# Altium schematic sheet ts2068Interface.SchDoc
size A; SheetNumber: 2; SheetTotal: 5
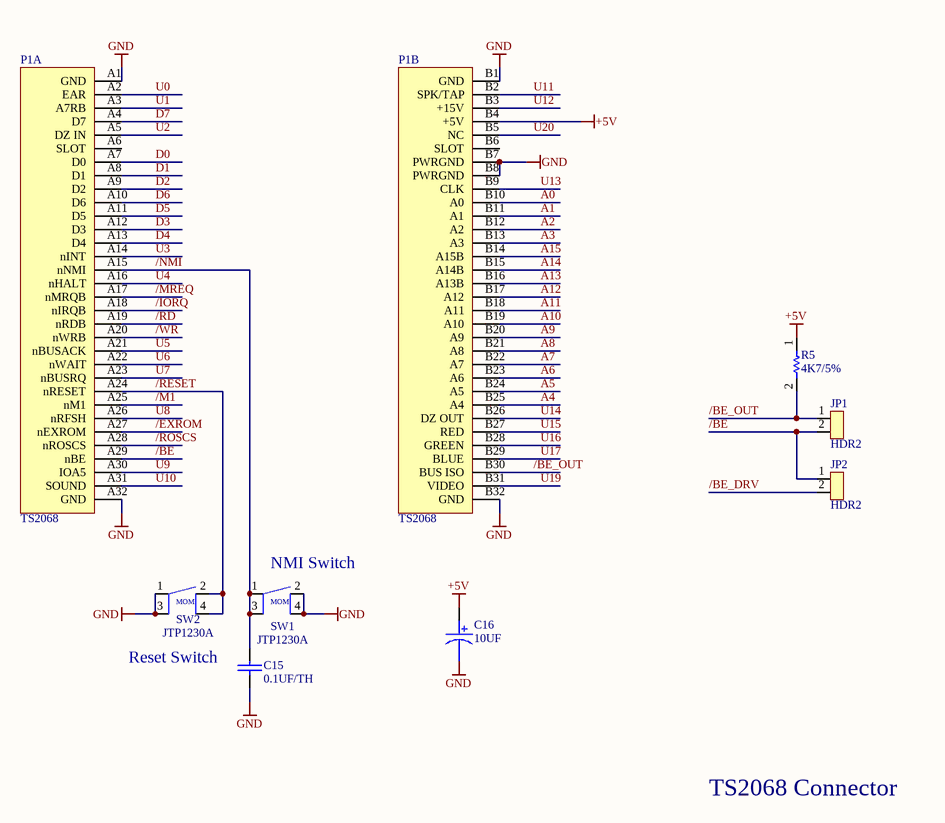
[diagram p0: ts2068Interface.SchDoc]

## Parts
C15  0.1UF/TH  [CAPH5]
C16  10UF  [CAP10EL]
JP1  HDR2  [HDR2]
JP2  HDR2  [HDR2]
P1  TS2068  [TS2068A]  (parts A,B of 2)
R5  4K7/5%  [CF18]
SW1  JTP1230A  [TACSW_6.5x4.5]
SW2  JTP1230A  [TACSW_6.5x4.5]

## Nets
+5V: C16.1 P1.B4(+5V) R5.1
GND: C15.1 C16.2 P1.A1(GND) P1.A32(GND) P1.B1(GND) P1.B7(PWRGND) P1.B8(PWRGND) P1.B32(GND) SW1.2 SW1.4 SW2.1 SW2.3
/BE: JP1.2 JP2.1 P1.A29(nBE)
/BE_DRV: JP2.2
/BE_OUT: JP1.1 P1.B30(BUS_ISO) R5.2
/EXROM: P1.A27(nEXROM)
/IORQ: P1.A18(nIRQB)
/M1: P1.A25(nM1)
/MREQ: P1.A17(nMRQB)
/NMI: C15.2 P1.A15(nNMI) SW1.1 SW1.3
/RD: P1.A19(nRDB)
/RESET: P1.A24(nRESET) SW2.2 SW2.4
/ROSCS: P1.A28(nROSCS)
/WR: P1.A20(nWRB)
A0: P1.B10(A0)
A1: P1.B11(A1)
A2: P1.B12(A2)
A3: P1.B13(A3)
A4: P1.B25(A4)
A5: P1.B24(A5)
A6: P1.B23(A6)
A7: P1.B22(A7)
A8: P1.B21(A8)
A9: P1.B20(A9)
A10: P1.B19(A10)
A11: P1.B18(A11)
A12: P1.B17(A12)
A13: P1.B16(A13B)
A14: P1.B15(A14B)
A15: P1.B14(A15B)
D0: P1.A7(D0)
D1: P1.A8(D1)
D2: P1.A9(D2)
D3: P1.A12(D3)
D4: P1.A13(D4)
D5: P1.A11(D5)
D6: P1.A10(D6)
D7: P1.A4(D7)
U0: P1.A2(EAR)
U1: P1.A3(A7RB)
U2: P1.A5(DZ_IN)
U3: P1.A14(nINT)
U4: P1.A16(nHALT)
U5: P1.A21(nBUSACK)
U6: P1.A22(nWAIT)
U7: P1.A23(nBUSRQ)
U8: P1.A26(nRFSH)
U9: P1.A30(IOA5)
U10: P1.A31(SOUND)
U11: P1.B2(SPK/TAP)
U12: P1.B3(+15V)
U13: P1.B9(CLK)
U14: P1.B26(DZ_OUT)
U15: P1.B27(RED)
U16: P1.B28(GREEN)
U17: P1.B29(BLUE)
U19: P1.B31(VIDEO)
U20: P1.B5(NC)

Not connected (* = marked no-connect by the designer): P1 A6(SLOT) B6(SLOT)

## Notes on the sheet
- (near SW1) NMI Switch
- (near C15) Reset Switch
- TS2068 Connector
- (in symbol JTP1230A) MOM

## Library data of the parts
C15 = 0.1UF/TH: 0.1 µF ±10% 50V Ceramic Capacitor X7R Radial; MFG: Vishay; MFG PN: K104K10X7RF5UH5; DK PN: BC2665CT-ND; Price: 1.17
C16 = 10UF: CAP ALUM 10UF 20% 16V RADIAL; MFG: Panasonic; MFG PN: ECE-A1CKA100; DK PN: P807-ND
R5 = 4K7/5%: RES 4.7K OHM 5% 1/8W AXIAL; MFG PN: CF18JT4K70; DK PN: CF18JT4K70CT-ND; MFG: Stackpole; Populate: *
SW1 SW2 = JTP1230A: Tactile Switch SPST-NO Top Actuated Through Hole; MFG: Apem; DK PN: 679-2429-ND; MFG PN: JTP1230A
P1 = TS2068: Populate: *